# EAGLE schematic ET312 (EAGLE 7.5.0)
ET312

## Sheet 1 of 2
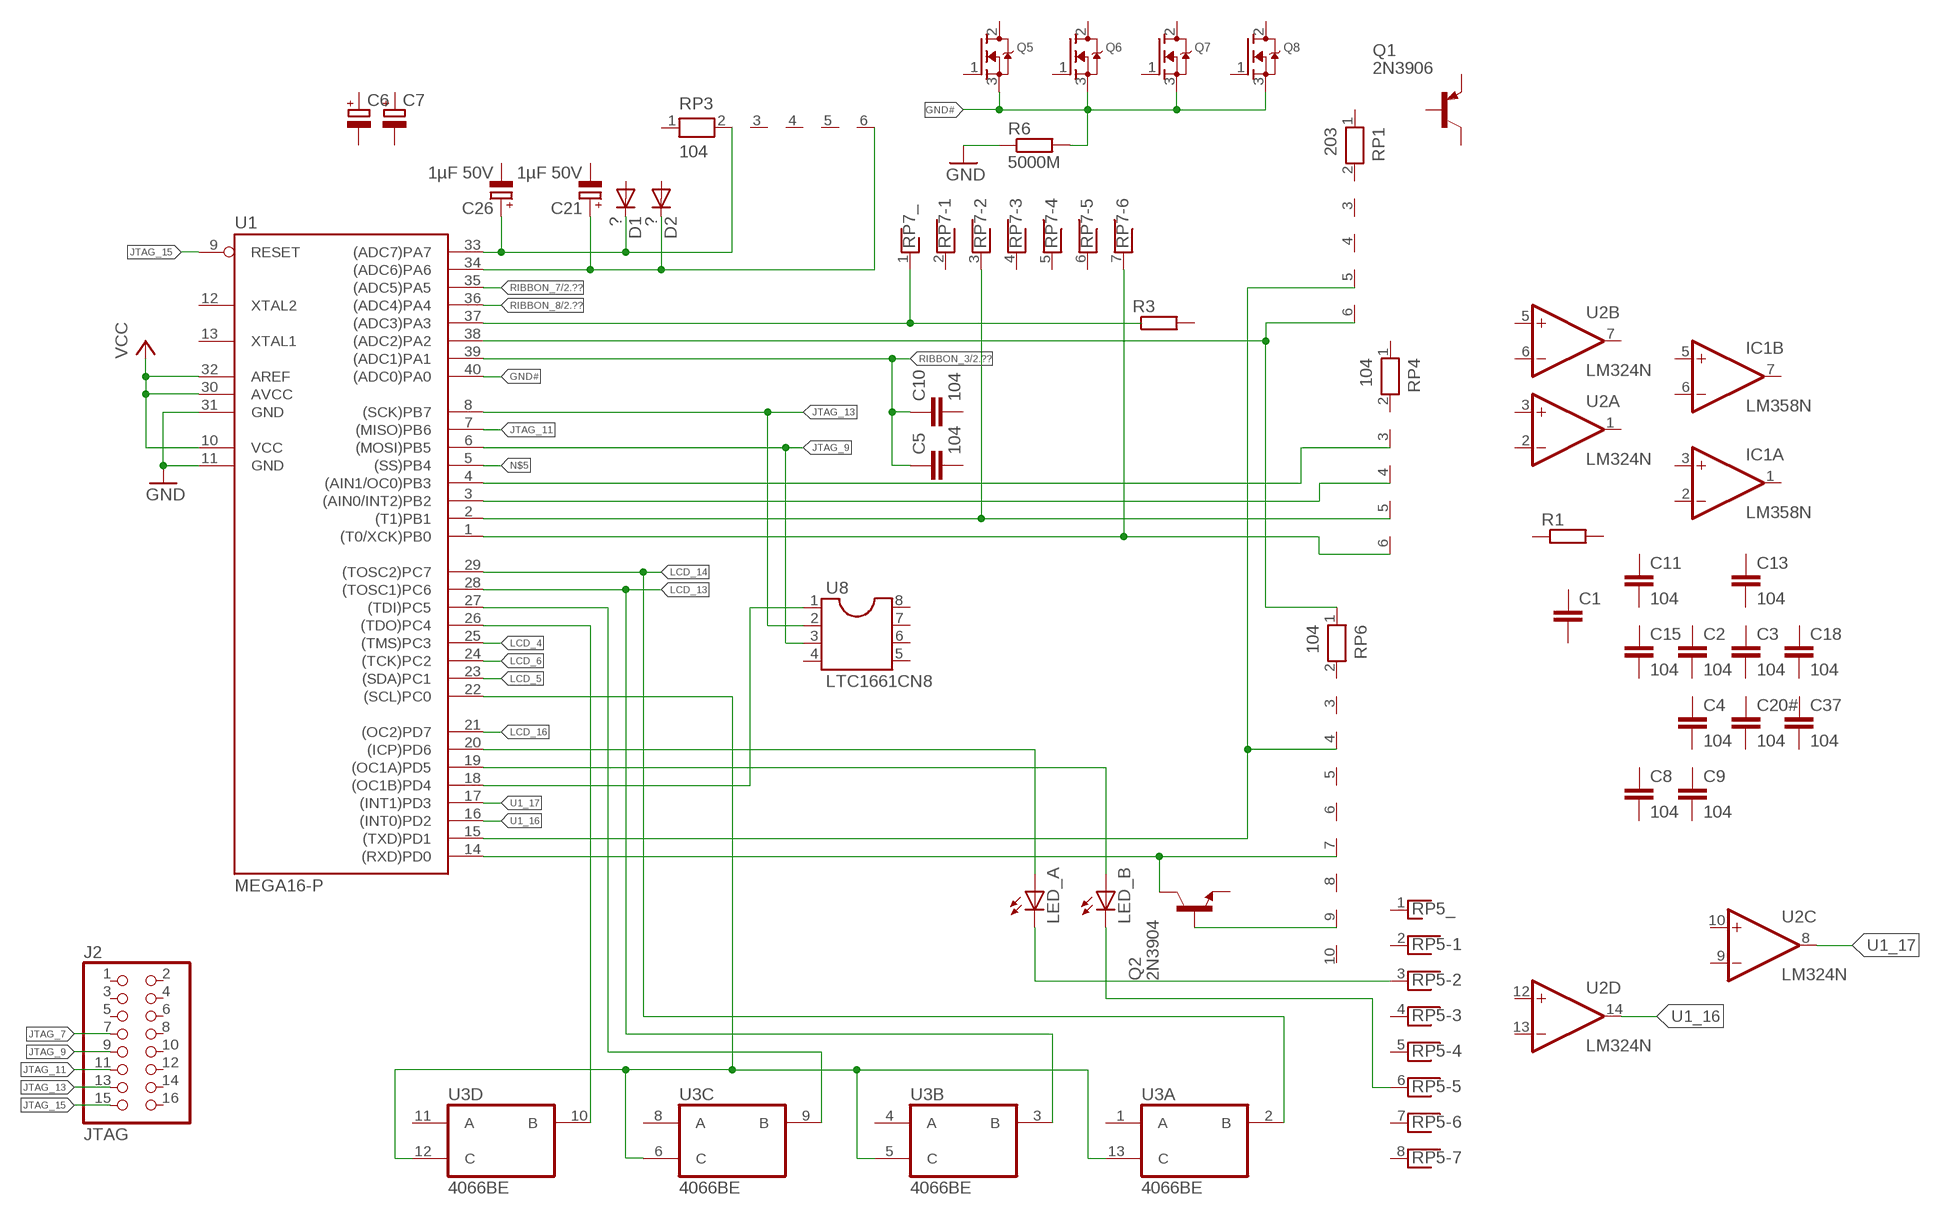
[diagram p0: schematic, sheet 1]

### Parts
C1  C-EU025-025X050  [C025-025X050]
C2  104  C-EU025-024X044  [C025-024X044]
C3  104  C-EU025-024X044  [C025-024X044]
C4  104  C-EU025-024X044  [C025-024X044]
C5  104  C-EU025-024X044  [C025-024X044]
C6  CPOL-EUE2-5  [E2-5]
C7  CPOL-EUE2-5  [E2-5]
C8  104  C-EU025-024X044  [C025-024X044]
C9  104  C-EU025-024X044  [C025-024X044]
C10  104  C-EU025-024X044  [C025-024X044]
C11  104  C-EU025-024X044  [C025-024X044]
C13  104  C-EU025-024X044  [C025-024X044]
C15  104  C-EU025-024X044  [C025-024X044]
C18  104  C-EU025-024X044  [C025-024X044]
C20#  104  C-EU025-024X044  [C025-024X044]
C21  1µF 50V  CPOL-EUE2-5  [E2-5]
C26  1µF 50V  CPOL-EUE2-5  [E2-5]
C37  104  C-EU025-024X044  [C025-024X044]
D1  ?  1N4004  [DO41-10]
D2  ?  1N4004  [DO41-10]
IC1  LM358N  [DIL08]
J2  JTAG  PINHD-2X8  [2X08]
LED_A  LEDB155  [Q62902-B155]
LED_B  LEDB155  [Q62902-B155]
Q1  2N3906  [TO92]
Q2  2N3904  [TO92]
Q5  MOSFET-NGDS_TO220V  [TO220V]
Q6  MOSFET-NGDS_TO220V  [TO220V]
Q7  MOSFET-NGDS_TO220V  [TO220V]
Q8  MOSFET-NGDS_TO220V  [TO220V]
R1  R-EU_0207/5V  [0207/5V]
R3  R-EU_0207/5V  [0207/5V]
R6  5000M  R-EU_0207/5V  [0207/5V]
RP1  203  RN05  [RN-6]
RP3  104  RN05  [RN-6]
RP4  104  RN05  [RN-6]
RP5  RNX7  [RN-8]
RP6  104  RN09  [RN-10]
RP7  RNX6  [RN-7]
U1  MEGA16-P  [DIL40]
U2  LM324N  [DIL14]
U3  4066BE  4066N  [DIL14]
U8  LTC1661CN8  DIL8  [DIL08]

### Nets
GND: R6.1 U1.11(GND) U1.31(GND)
GND#: Q5.3(S) Q6.3(S) Q7.3(S) Q8.3(S) R6.2 U1.40((ADC0)PA0)
JTAG_7: J2.7 RP4.3 U1.4((AIN1/OC0)PB3)
JTAG_9: J2.9 U1.6((MOSI)PB5) U8.3
JTAG_11: J2.11 U1.7((MISO)PB6)
JTAG_13: J2.13 U1.8((SCK)PB7) U8.2
JTAG_15: J2.15 U1.9(RESET)
LCD_4: U1.25((TMS)PC3)
LCD_5: U1.23((SDA)PC1)
LCD_6: U1.24((TCK)PC2)
LCD_13: U1.28((TOSC1)PC6) U3.3(B:B)
LCD_14: U1.29((TOSC2)PC7) U3.2(A:B)
LCD_16: U1.21((OC2)PD7)
N$1: RP4.6 RP7.7 U1.1((T0/XCK)PB0)
N$2: RP4.5 RP7.3 U1.2((T1)PB1)
N$3: RP4.4 U1.3((AIN0/INT2)PB2)
N$4: Q2.1(C) RP6.7 U1.14((RXD)PD0)
N$5: U1.5((SS)PB4)
N$6: RP1.5 RP6.4 U1.15((TXD)PD1)
N$7: LED_A.K(C) RP5.3
N$8: LED_B.K(C) RP5.6
N$9: U1.18((OC1B)PD4) U8.1
N$10: LED_B.A U1.19((OC1A)PD5)
N$11: LED_A.A U1.20((ICP)PD6)
N$12: U1.22((SCL)PC0) U3.5(B:C) U3.6(C:C) U3.12(D:C) U3.13(A:C)
N$13: U1.26((TDO)PC4)
N$14: U1.27((TDI)PC5) U3.9(C:B)
N$15: C26.+ D1.C RP3.2 U1.33((ADC7)PA7)
N$16: C21.+ D2.C RP3.6 U1.34((ADC6)PA6)
N$17: R3.1 RP7.1 U1.37((ADC3)PA3)
N$18: RP1.6 RP6.1 U1.38((ADC2)PA2)
N$19: Q2.2(B) RP6.9
RIBBON_3: C5.1 C10.1 U1.39((ADC1)PA1) ; also sheet 2
RIBBON_7: U1.35((ADC5)PA5) ; also sheet 2
RIBBON_8: U1.36((ADC4)PA4) ; also sheet 2
U1_16: U1.16((INT0)PD2) U2.14(D:OUT)
U1_17: U1.17((INT1)PD3) U2.8(C:OUT)
VCC: U1.10(VCC) U1.30(AVCC) U1.32(AREF)
Unconnected: C1.1 C1.2 C2.1 C2.2 C3.1 C3.2 C4.1 C4.2 C5.2 C6.+ C6.- C7.+ C7.- C8.1 C8.2 C9.1 C9.2 C10.2 C11.1 C11.2 C13.1 C13.2 C15.1 C15.2 C18.1 C18.2 C20#.1 C20#.2 C21.- C26.- C37.1 C37.2 D1.A D2.A IC1.1(A:OUT) IC1.2(A:-IN) IC1.3(A:+IN) IC1.5(B:+IN) IC1.6(B:-IN) IC1.7(B:OUT) J2.1 J2.2 J2.3 J2.4 J2.5 J2.6 J2.8 J2.10 J2.12 J2.14 J2.16 Q1.1(C) Q1.2(B) Q1.3(E) Q2.3(E) Q5.1(G) Q5.2(D) Q6.1(G) Q6.2(D) Q7.1(G) Q7.2(D) Q8.1(G) Q8.2(D) R1.1 R1.2 R3.2 RP1.1 RP1.2 RP1.3 RP1.4 RP3.1 RP3.3 RP3.4 RP3.5 RP4.1 RP4.2 RP5.1 RP5.2 RP5.4 RP5.5 RP5.7 RP5.8 RP6.2 RP6.3 RP6.5 RP6.6 RP6.8 RP6.10 RP7.2 RP7.4 RP7.5 RP7.6 U1.12(XTAL2) U1.13(XTAL1) U2.1(A:OUT) U2.2(A:-IN) U2.3(A:+IN) U2.5(B:+IN) U2.6(B:-IN) U2.7(B:OUT) U2.9(C:-IN) U2.10(C:+IN) U2.12(D:+IN) U2.13(D:-IN) U3.1(A:A) U3.4(B:A) U3.8(C:A) U3.10(D:B) U3.11(D:A) U8.4 U8.5 U8.6 U8.7 U8.8

## Sheet 2 of 2
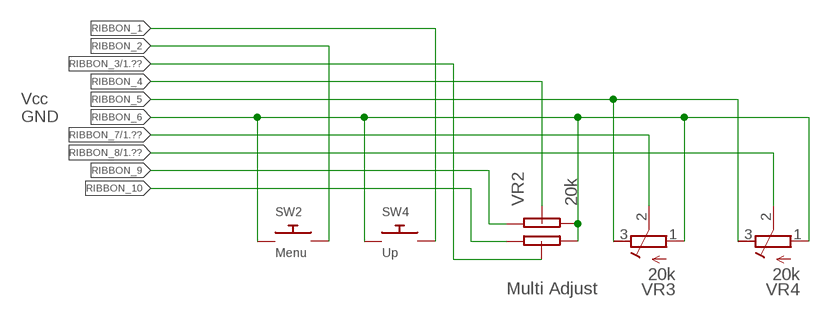
[diagram p1: schematic, sheet 2]

### Parts
SW2  Menu  SWITCH_PUSHBUTTONEVQ-PE  [TACT_PANA-EVQ]
SW4  Up  SWITCH_PUSHBUTTONEVQ-PE  [TACT_PANA-EVQ]
VR2  20k  EVJC  [EVJC]
VR3  20k  R-TRIMM64W  [RTRIM64W]
VR4  20k  R-TRIMM64W  [RTRIM64W]

### Nets
RIBBON_1: SW4.P$2
RIBBON_2: SW2.P$2
RIBBON_3: VR2.I2 ; also sheet 1
RIBBON_4: VR2.II2
RIBBON_5: VR3.3(E) VR4.3(E)
RIBBON_6: SW2.P$1 SW4.P$1 VR2.I1 VR2.II1 VR3.1(A) VR4.1(A)
RIBBON_7: VR3.2(S) ; also sheet 1
RIBBON_8: VR4.2(S) ; also sheet 1
RIBBON_9: VR2.II3
RIBBON_10: VR2.I3

### Notes on the sheet
- Vcc
- GND
- Multi Adjust

## Power pins joined to a net without a drawn wire
V+: IC1.8(P:V+) U2.4(P:V+)
V-: IC1.4(P:V-) U2.11(P:V-)
VDD: U3.14(P:VDD)
VSS: U3.7(P:VSS)

## Library data of the parts
C1 = resistor:C-EU: CAPACITOR, European symbol
C2-C5 C8-C11 C13 C15 C18 C20# C37 = rcl:C-EU: CAPACITOR, European symbol
C6 C7 C21 C26 = rcl:CPOL-EU: POLARIZED CAPACITOR, European symbol
D1 D2 = adafruit:1N4004: DIODE General purpose 1N400x type rectifier (With bigger pads) http://www.ladyada.net/library/pcb/eaglelibrary.html
IC1 = linear:LM358: OP AMP also LM158; LM258; LM2904 Source: http://cache.national.com/ds/LM/LM158.pdf
J2 = pinhead:PINHD-2X8: PIN HEADER
LED_A LED_B = adafruit:LED: LED OSRAM: - CHIPLED LG R971, LG N971, LY N971, LG Q971, LY Q971, LO R971, LY R971 LH N974, LH R974 LS Q976, LO Q976, LY Q976 LO Q996 - Hyper CHIPLED LW Q18S LB Q993, LB Q99A, LB R99A - SideLED LS A670, LO A670, LY A670, LG A670, LP A670 LB A673, LV A673, LT A673, LW A673 LH A674 LY A675 LS A676, LA A676, LO A676, LY A676, LW A676 LS A679, LY A679, LG A679 - Hyper Micro SIDELED® LS Y876, LA Y876, LO Y876, LY Y876 LT Y87S - SmartLED LW L88C, LW L88S LB L89C, LB L89S, LG L890 LS L89K, LO L89K, LY L89K LS L896, LA L896, LO L896, LY L896 - TOPLED LS T670, LO T670, LY T670, LG T670, LP T670 LSG T670, LSP T670, LSY T670, LOP T670, LYG T670 LG T671, LOG T671, LSG T671 LB T673, LV T673, LT T673, LW T673 LH T674 LS T676, LA T676, LO T676, LY T676, LB T676, LH T676, LSB T676, LW T676 LB T67C, LV T67C, LT T67C, LS T67K, LO T67K, LY T67K, LW E67C LS E67B, LA E67B, LO E67B, LY E67B, LB E67C, LV E67C, LT E67C LW T67C LS T679, LY T679, LG T679 LS T770, LO T770, LY T770, LG T770, LP T770 LB T773, LV T773, LT T773, LW T773 LH T774 LS E675, LA E675, LY E675, LS T675 LS T776, LA T776, LO T776, LY T776, LB T776 LHGB T686 LT T68C, LB T68C - Hyper Mini TOPLED® LB M676 - Mini TOPLED Santana® LG M470 LS M47K, LO M47K, LY M47K Source: http://www.osram.convergy.de/
Q1 = transistor-pnp:2N3906: PNP Transistor
Q2 = transistor-npn:2N3904: NPN Transistor
Q5-Q8 = adafruit:MOSFET-N: N-Channel Mosfet 2N7002E - 60V 260mA SOT23 [Digikey: 2N7002ET1GOSTR-ND] - REEL BSH103 - 30V 850mA SOT23 [Digikey: 568-5013-1-ND]
R1 R3 R6 = resistor:R-EU_: RESISTOR, European symbol
RP1 RP3 RP4 = resistor-net:RN05: RESISTOR NETWORK; OC_FARNELL: unknown; OC_NEWARK: unknown
RP5 = resistor-net:RNX7: RESISTOR NETWORK; OC_FARNELL: unknown; OC_NEWARK: unknown
RP6 = resistor-net:RN09: RESISTOR NETWORK; OC_FARNELL: unknown; OC_NEWARK: unknown
RP7 = resistor-net:RNX6: RESISTOR NETWORK; OC_FARNELL: unknown; OC_NEWARK: unknown
SW2 SW4 = adafruit:SWITCH_PUSHBUTTON: Buttons SOFTTOUCHSMD_SJ - Soft touch temporary push button (Super Junk Akihabara) Compatible with SKPMANE010 [Mouser: 688-SKPMAN] C&K_KSS = Digikey: KSS221GLFS
U1 = atmel:MEGA16-P: MICROCONTROLLER 16 Kbytes FLASH 1 kbytes SRAM 512 bytes EEPROM USART 8-channel 10 bit ADC Source: avr.lbr; MPN: ATMEGA16-16PU; OC_FARNELL: 9171142; OC_NEWARK: 01M6885
U2 = linear:LM324: OP AMP
U3 = 40xx:4066: Quad bilateral ANALOG SWITCH
U8 = ic-package:DIL8: Dual In Line / Socket
VR2 = Zefiro:EVJC
VR3 VR4 = rcl:R-TRIMM: Trimm resistor